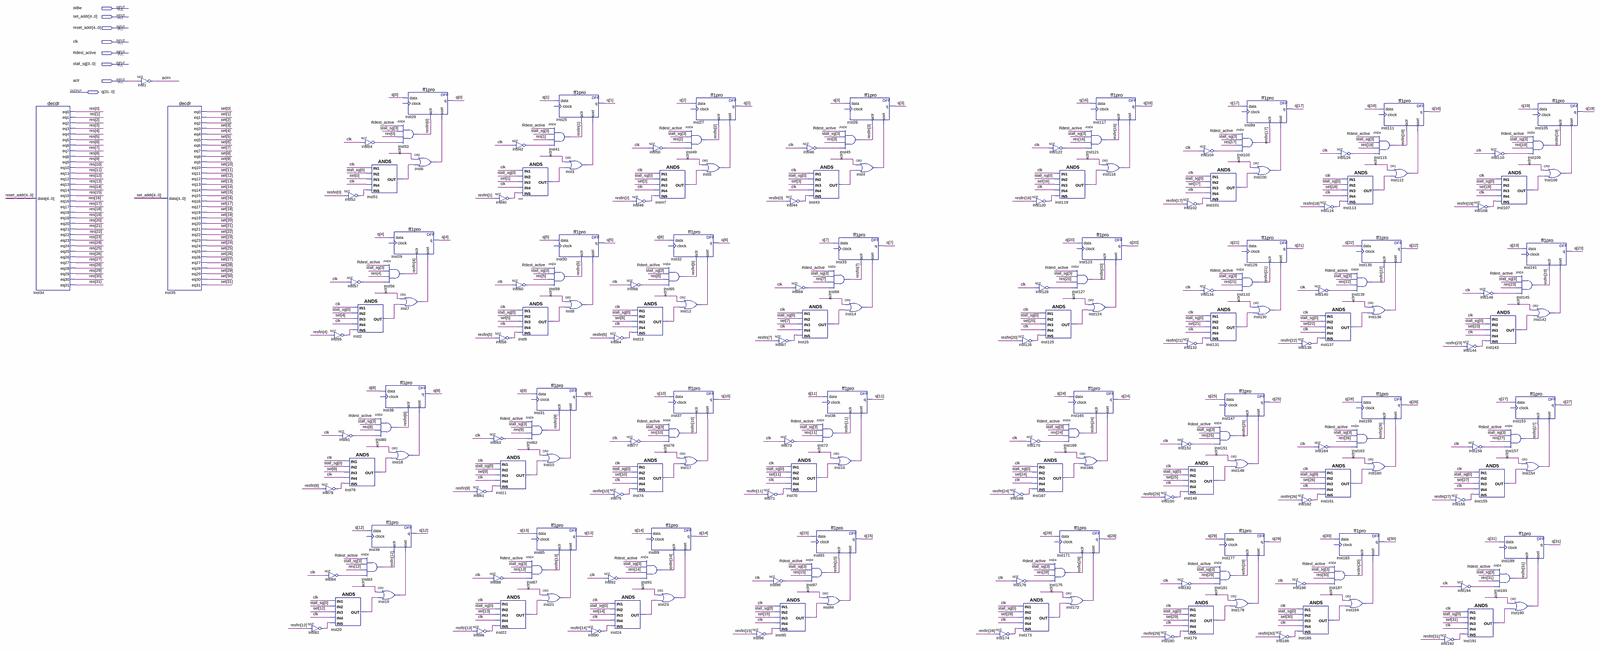
[diagram p0: schematic sheet, whole]
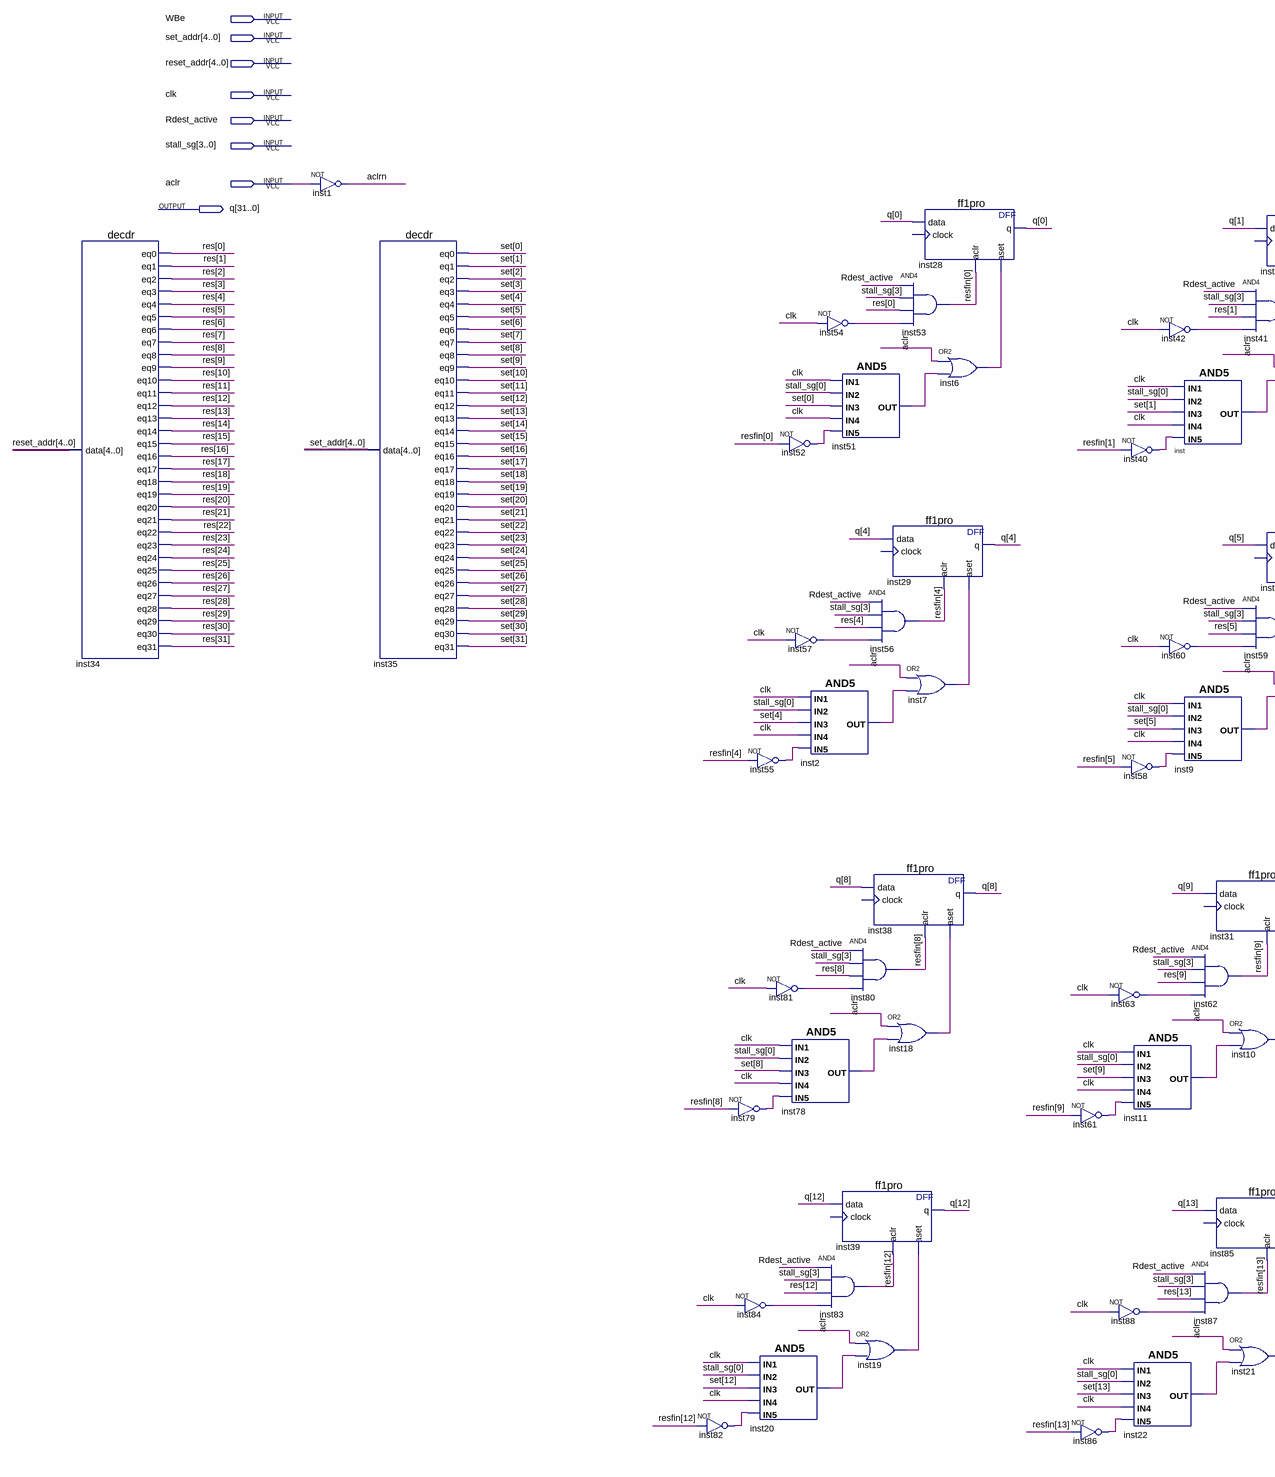
[diagram p1: schematic sheet, left part]
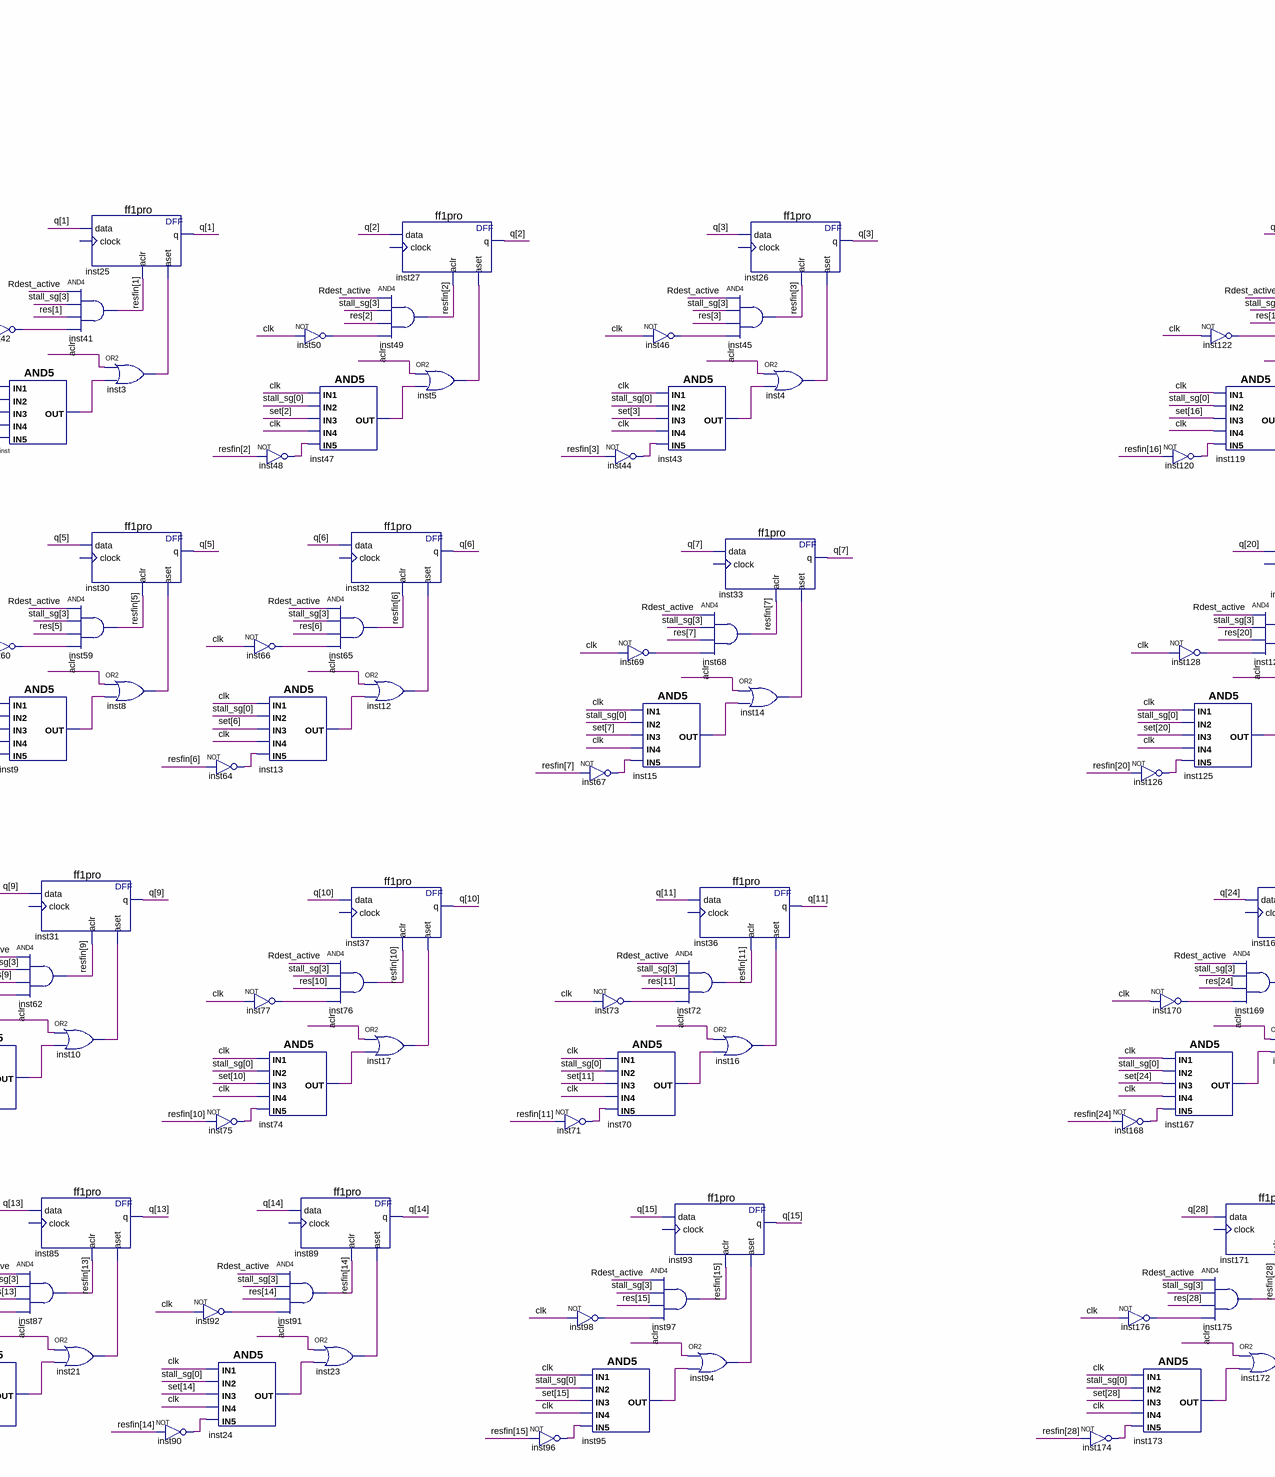
[diagram p2: schematic sheet, centre part]
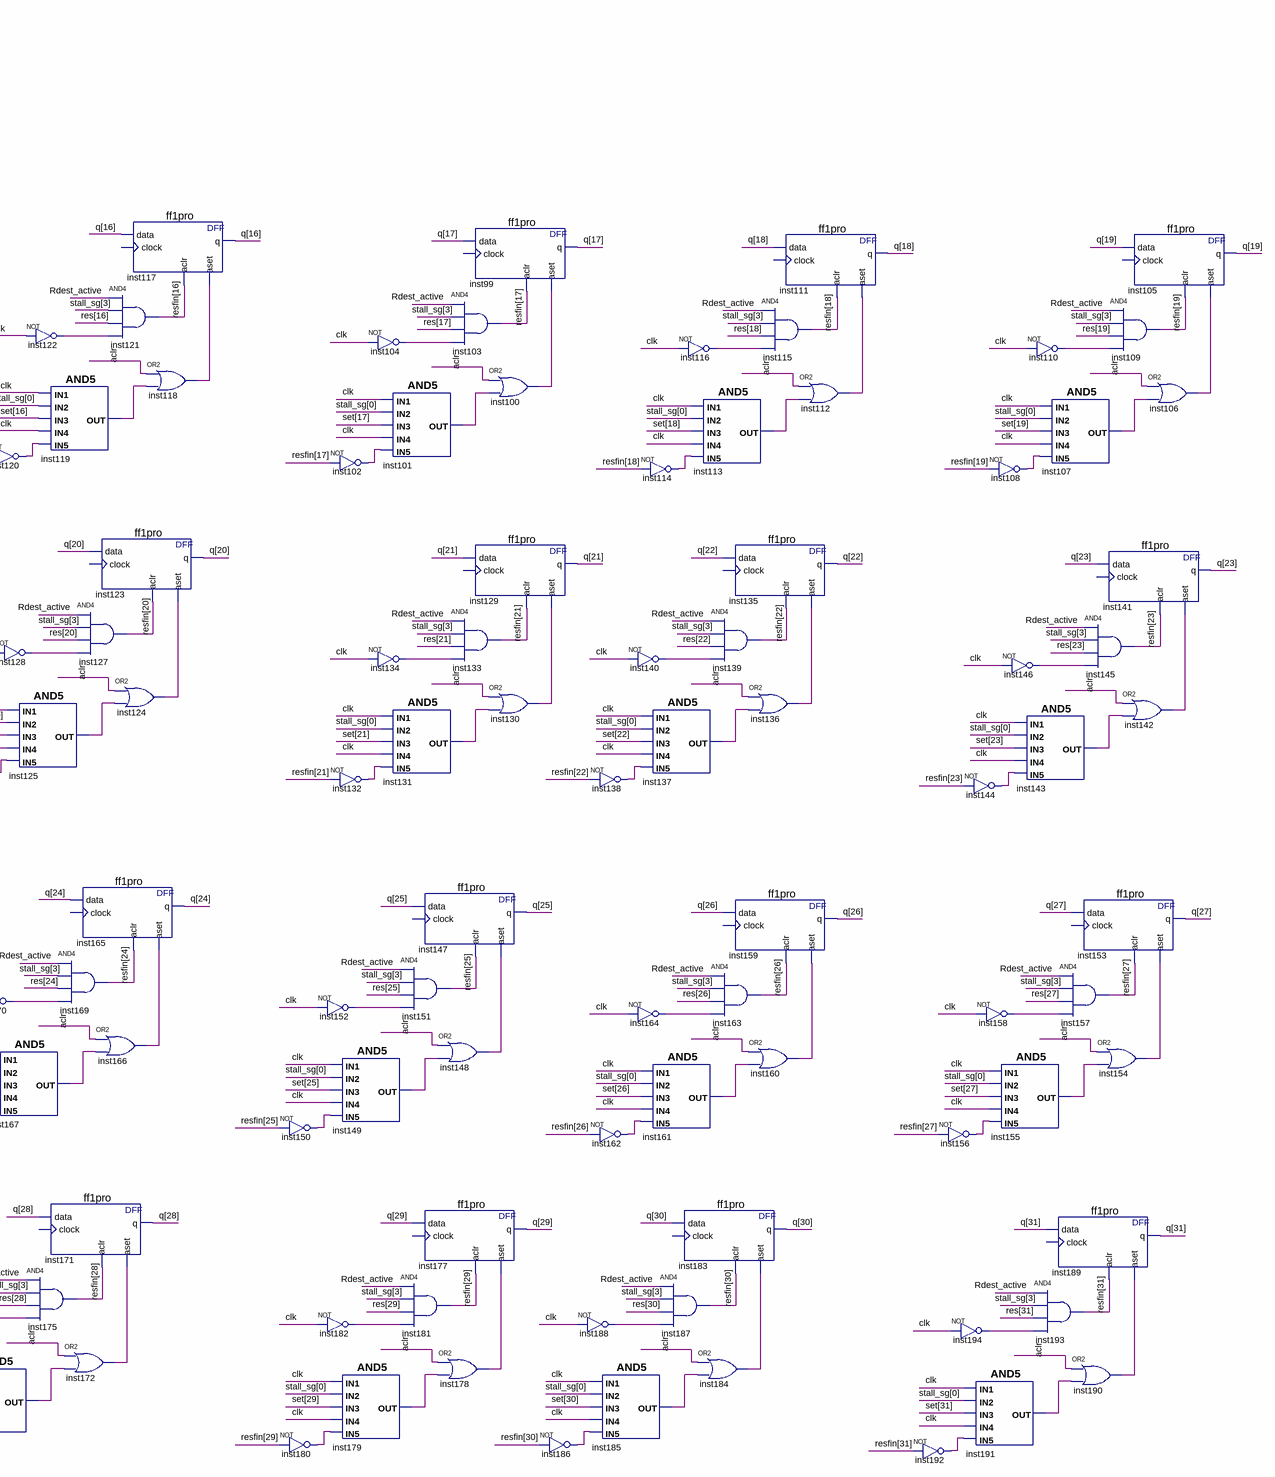
[diagram p3: schematic sheet, right part]
// Quartus schematic Stall_Array.bdf as structural Verilog: 195 symbols, 8 pins
module Stall_Array (
  input  WBe,
  input  [4:0] set_addr,
  input  [4:0] reset_addr,
  input  clk,
  input  Rdest_active,
  input  [3:0] stall_sg,
  input  aclr,
  output [31:0] q
);

  wire aclrn, inst2_out, inst3_out, inst4_out, inst5_out, inst6_out, inst7_out, inst8_out, inst9_out,
       inst10_out, inst11_out, inst12_out, inst13_out, inst14_out, inst15_out, inst16_out, inst17_out,
       inst18_out, inst19_out, inst20_out, inst21_out, inst22_out, inst23_out, inst24_out, inst40_out,
       inst42_out, inst43_out, inst44_out, inst46_out, inst47_out, inst48_out, inst50_out, inst51_out,
       inst52_out, inst54_out, inst55_out, inst57_out, inst58_out, inst60_out, inst61_out, inst63_out,
       inst64_out, inst66_out, inst67_out, inst69_out, inst70_out, inst71_out, inst73_out, inst74_out,
       inst75_out, inst77_out, inst78_out, inst79_out, inst81_out, inst82_out, inst84_out, inst86_out,
       inst88_out, inst90_out, inst92_out, inst94_out, inst95_out, inst96_out, inst98_out, inst100_out,
       inst101_out, inst102_out, inst104_out, inst106_out, inst107_out, inst108_out, inst110_out,
       inst112_out, inst113_out, inst114_out, inst116_out, inst118_out, inst119_out, inst120_out,
       inst122_out, inst124_out, inst125_out, inst126_out, inst128_out, inst130_out, inst131_out,
       inst132_out, inst134_out, inst136_out, inst137_out, inst138_out, inst140_out, inst142_out,
       inst143_out, inst144_out, inst146_out, inst148_out, inst149_out, inst150_out, inst152_out,
       inst154_out, inst155_out, inst156_out, inst158_out, inst160_out, inst161_out, inst162_out,
       inst164_out, inst166_out, inst167_out, inst168_out, inst170_out, inst172_out, inst173_out,
       inst174_out, inst176_out, inst178_out, inst179_out, inst180_out, inst182_out, inst184_out,
       inst185_out, inst186_out, inst188_out, inst190_out, inst191_out, inst192_out, inst194_out, inst_out;
  wire [31:0] res, resfin, set;

  decdr inst34 (
    .data(reset_addr), .eq0(res[0]), .eq1(res[1]), .eq2(res[2]), .eq3(res[3]), .eq4(res[4]), .eq5(res[5]),
    .eq6(res[6]), .eq7(res[7]), .eq8(res[8]), .eq9(res[9]), .eq10(res[10]), .eq11(res[11]), .eq12(res[12]),
    .eq13(res[13]), .eq14(res[14]), .eq15(res[15]), .eq16(res[16]), .eq17(res[17]), .eq18(res[18]),
    .eq19(res[19]), .eq20(res[20]), .eq21(res[21]), .eq22(res[22]), .eq23(res[23]), .eq24(res[24]),
    .eq25(res[25]), .eq26(res[26]), .eq27(res[27]), .eq28(res[28]), .eq29(res[29]), .eq30(res[30]),
    .eq31(res[31]));
  not inst1 (aclrn, aclr);
  decdr inst35 (
    .data(set_addr), .eq0(set[0]), .eq1(set[1]), .eq2(set[2]), .eq3(set[3]), .eq4(set[4]), .eq5(set[5]),
    .eq6(set[6]), .eq7(set[7]), .eq8(set[8]), .eq9(set[9]), .eq10(set[10]), .eq11(set[11]), .eq12(set[12]),
    .eq13(set[13]), .eq14(set[14]), .eq15(set[15]), .eq16(set[16]), .eq17(set[17]), .eq18(set[18]),
    .eq19(set[19]), .eq20(set[20]), .eq21(set[21]), .eq22(set[22]), .eq23(set[23]), .eq24(set[24]),
    .eq25(set[25]), .eq26(set[26]), .eq27(set[27]), .eq28(set[28]), .eq29(set[29]), .eq30(set[30]),
    .eq31(set[31]));
  not inst82 (inst82_out, resfin[12]);
  not inst55 (inst55_out, resfin[4]);
  not inst79 (inst79_out, resfin[8]);
  not inst84 (inst84_out, clk);
  and inst20 (inst20_out, clk, stall_sg[0], set[12], clk, inst82_out);
  not inst52 (inst52_out, resfin[0]);
  not inst57 (inst57_out, clk);
  and inst2 (inst2_out, clk, stall_sg[0], set[4], clk, inst55_out);
  not inst81 (inst81_out, clk);
  and inst78 (inst78_out, clk, stall_sg[0], set[8], clk, inst79_out);
  not inst54 (inst54_out, clk);
  and inst51 (inst51_out, clk, stall_sg[0], set[0], clk, inst52_out);
  and inst80 (resfin[8], Rdest_active, stall_sg[3], res[8], inst81_out);
  ff1pro inst39 (.data(q[12]), .aclr(resfin[12]), .aset(inst19_out), .q(q[12]));  // open: clock
  and inst83 (resfin[12], Rdest_active, stall_sg[3], res[12], inst84_out);
  or inst19 (inst19_out, aclr, inst20_out);
  and inst53 (resfin[0], Rdest_active, stall_sg[3], res[0], inst54_out);
  ff1pro inst29 (.data(q[4]), .aclr(resfin[4]), .aset(inst7_out), .q(q[4]));  // open: clock
  and inst56 (resfin[4], Rdest_active, stall_sg[3], res[4], inst57_out);
  or inst7 (inst7_out, aclr, inst2_out);
  ff1pro inst38 (.data(q[8]), .aclr(resfin[8]), .aset(inst18_out), .q(q[8]));  // open: clock
  or inst18 (inst18_out, aclr, inst78_out);
  ff1pro inst28 (.data(q[0]), .aclr(resfin[0]), .aset(inst6_out), .q(q[0]));  // open: clock
  or inst6 (inst6_out, aclr, inst51_out);
  not inst63 (inst63_out, clk);
  not inst61 (inst61_out, resfin[9]);
  not inst88 (inst88_out, clk);
  not inst86 (inst86_out, resfin[13]);
  not inst42 (inst42_out, clk);
  not inst40 (inst40_out, resfin[1]);
  not inst60 (inst60_out, clk);
  not inst58 (inst58_out, resfin[5]);
  and inst11 (inst11_out, clk, stall_sg[0], set[9], clk, inst61_out);
  and inst22 (inst22_out, clk, stall_sg[0], set[13], clk, inst86_out);
  and inst (inst_out, clk, stall_sg[0], set[1], clk, inst40_out);
  and inst9 (inst9_out, clk, stall_sg[0], set[5], clk, inst58_out);
  ff1pro inst31 (.data(q[9]), .aclr(resfin[9]), .aset(inst10_out), .q(q[9]));  // open: clock
  and inst62 (resfin[9], Rdest_active, stall_sg[3], res[9], inst63_out);
  ff1pro inst85 (.data(q[13]), .aclr(resfin[13]), .aset(inst21_out), .q(q[13]));  // open: clock
  and inst87 (resfin[13], Rdest_active, stall_sg[3], res[13], inst88_out);
  ff1pro inst25 (.data(q[1]), .aclr(resfin[1]), .aset(inst3_out), .q(q[1]));  // open: clock
  and inst41 (resfin[1], Rdest_active, stall_sg[3], res[1], inst42_out);
  ff1pro inst30 (.data(q[5]), .aclr(resfin[5]), .aset(inst8_out), .q(q[5]));  // open: clock
  and inst59 (resfin[5], Rdest_active, stall_sg[3], res[5], inst60_out);
  or inst10 (inst10_out, aclr, inst11_out);
  or inst21 (inst21_out, aclr, inst22_out);
  or inst3 (inst3_out, aclr, inst_out);
  or inst8 (inst8_out, aclr, inst9_out);
  not inst90 (inst90_out, resfin[14]);
  not inst64 (inst64_out, resfin[6]);
  not inst75 (inst75_out, resfin[10]);
  not inst92 (inst92_out, clk);
  and inst24 (inst24_out, clk, stall_sg[0], set[14], clk, inst90_out);
  not inst48 (inst48_out, resfin[2]);
  not inst66 (inst66_out, clk);
  and inst13 (inst13_out, clk, stall_sg[0], set[6], clk, inst64_out);
  not inst77 (inst77_out, clk);
  and inst74 (inst74_out, clk, stall_sg[0], set[10], clk, inst75_out);
  ff1pro inst89 (.data(q[14]), .aclr(resfin[14]), .aset(inst23_out), .q(q[14]));  // open: clock
  and inst91 (resfin[14], Rdest_active, stall_sg[3], res[14], inst92_out);
  not inst50 (inst50_out, clk);
  and inst47 (inst47_out, clk, stall_sg[0], set[2], clk, inst48_out);
  ff1pro inst32 (.data(q[6]), .aclr(resfin[6]), .aset(inst12_out), .q(q[6]));  // open: clock
  and inst65 (resfin[6], Rdest_active, stall_sg[3], res[6], inst66_out);
  ff1pro inst37 (.data(q[10]), .aclr(resfin[10]), .aset(inst17_out), .q(q[10]));  // open: clock
  and inst76 (resfin[10], Rdest_active, stall_sg[3], res[10], inst77_out);
  or inst23 (inst23_out, aclr, inst24_out);
  ff1pro inst27 (.data(q[2]), .aclr(resfin[2]), .aset(inst5_out), .q(q[2]));  // open: clock
  and inst49 (resfin[2], Rdest_active, stall_sg[3], res[2], inst50_out);
  or inst12 (inst12_out, aclr, inst13_out);
  or inst17 (inst17_out, aclr, inst74_out);
  or inst5 (inst5_out, aclr, inst47_out);
  not inst96 (inst96_out, resfin[15]);
  not inst67 (inst67_out, resfin[7]);
  not inst73 (inst73_out, clk);
  not inst71 (inst71_out, resfin[11]);
  not inst98 (inst98_out, clk);
  and inst95 (inst95_out, clk, stall_sg[0], set[15], clk, inst96_out);
  not inst46 (inst46_out, clk);
  not inst44 (inst44_out, resfin[3]);
  not inst69 (inst69_out, clk);
  and inst15 (inst15_out, clk, stall_sg[0], set[7], clk, inst67_out);
  and inst70 (inst70_out, clk, stall_sg[0], set[11], clk, inst71_out);
  and inst43 (inst43_out, clk, stall_sg[0], set[3], clk, inst44_out);
  ff1pro inst36 (.data(q[11]), .aclr(resfin[11]), .aset(inst16_out), .q(q[11]));  // open: clock
  and inst72 (resfin[11], Rdest_active, stall_sg[3], res[11], inst73_out);
  ff1pro inst93 (.data(q[15]), .aclr(resfin[15]), .aset(inst94_out), .q(q[15]));  // open: clock
  and inst97 (resfin[15], Rdest_active, stall_sg[3], res[15], inst98_out);
  or inst94 (inst94_out, aclr, inst95_out);
  ff1pro inst26 (.data(q[3]), .aclr(resfin[3]), .aset(inst4_out), .q(q[3]));  // open: clock
  and inst45 (resfin[3], Rdest_active, stall_sg[3], res[3], inst46_out);
  ff1pro inst33 (.data(q[7]), .aclr(resfin[7]), .aset(inst14_out), .q(q[7]));  // open: clock
  and inst68 (resfin[7], Rdest_active, stall_sg[3], res[7], inst69_out);
  or inst14 (inst14_out, aclr, inst15_out);
  or inst16 (inst16_out, aclr, inst70_out);
  or inst4 (inst4_out, aclr, inst43_out);
  not inst174 (inst174_out, resfin[28]);
  not inst126 (inst126_out, resfin[20]);
  not inst170 (inst170_out, clk);
  not inst168 (inst168_out, resfin[24]);
  not inst176 (inst176_out, clk);
  and inst173 (inst173_out, clk, stall_sg[0], set[28], clk, inst174_out);
  not inst122 (inst122_out, clk);
  not inst120 (inst120_out, resfin[16]);
  not inst128 (inst128_out, clk);
  and inst125 (inst125_out, clk, stall_sg[0], set[20], clk, inst126_out);
  and inst167 (inst167_out, clk, stall_sg[0], set[24], clk, inst168_out);
  and inst175 (resfin[28], Rdest_active, stall_sg[3], res[28], inst176_out);
  and inst119 (inst119_out, clk, stall_sg[0], set[16], clk, inst120_out);
  and inst127 (resfin[20], Rdest_active, stall_sg[3], res[20], inst128_out);
  ff1pro inst165 (.data(q[24]), .aclr(resfin[24]), .aset(inst166_out), .q(q[24]));  // open: clock
  and inst169 (resfin[24], Rdest_active, stall_sg[3], res[24], inst170_out);
  ff1pro inst171 (.data(q[28]), .aclr(resfin[28]), .aset(inst172_out), .q(q[28]));  // open: clock
  or inst172 (inst172_out, aclr, inst173_out);
  ff1pro inst117 (.data(q[16]), .aclr(resfin[16]), .aset(inst118_out), .q(q[16]));  // open: clock
  and inst121 (resfin[16], Rdest_active, stall_sg[3], res[16], inst122_out);
  ff1pro inst123 (.data(q[20]), .aclr(resfin[20]), .aset(inst124_out), .q(q[20]));  // open: clock
  or inst124 (inst124_out, aclr, inst125_out);
  or inst166 (inst166_out, aclr, inst167_out);
  or inst118 (inst118_out, aclr, inst119_out);
  not inst150 (inst150_out, resfin[25]);
  not inst180 (inst180_out, resfin[29]);
  not inst102 (inst102_out, resfin[17]);
  not inst132 (inst132_out, resfin[21]);
  not inst152 (inst152_out, clk);
  and inst149 (inst149_out, clk, stall_sg[0], set[25], clk, inst150_out);
  not inst182 (inst182_out, clk);
  and inst179 (inst179_out, clk, stall_sg[0], set[29], clk, inst180_out);
  not inst104 (inst104_out, clk);
  and inst101 (inst101_out, clk, stall_sg[0], set[17], clk, inst102_out);
  not inst134 (inst134_out, clk);
  and inst131 (inst131_out, clk, stall_sg[0], set[21], clk, inst132_out);
  ff1pro inst147 (.data(q[25]), .aclr(resfin[25]), .aset(inst148_out), .q(q[25]));  // open: clock
  and inst151 (resfin[25], Rdest_active, stall_sg[3], res[25], inst152_out);
  ff1pro inst177 (.data(q[29]), .aclr(resfin[29]), .aset(inst178_out), .q(q[29]));  // open: clock
  and inst181 (resfin[29], Rdest_active, stall_sg[3], res[29], inst182_out);
  ff1pro inst99 (.data(q[17]), .aclr(resfin[17]), .aset(inst100_out), .q(q[17]));  // open: clock
  and inst103 (resfin[17], Rdest_active, stall_sg[3], res[17], inst104_out);
  ff1pro inst129 (.data(q[21]), .aclr(resfin[21]), .aset(inst130_out), .q(q[21]));  // open: clock
  and inst133 (resfin[21], Rdest_active, stall_sg[3], res[21], inst134_out);
  or inst148 (inst148_out, aclr, inst149_out);
  or inst178 (inst178_out, aclr, inst179_out);
  or inst100 (inst100_out, aclr, inst101_out);
  or inst130 (inst130_out, aclr, inst131_out);
  not inst188 (inst188_out, clk);
  not inst186 (inst186_out, resfin[30]);
  not inst140 (inst140_out, clk);
  not inst138 (inst138_out, resfin[22]);
  not inst164 (inst164_out, clk);
  not inst162 (inst162_out, resfin[26]);
  and inst185 (inst185_out, clk, stall_sg[0], set[30], clk, inst186_out);
  not inst116 (inst116_out, clk);
  not inst114 (inst114_out, resfin[18]);
  and inst137 (inst137_out, clk, stall_sg[0], set[22], clk, inst138_out);
  and inst161 (inst161_out, clk, stall_sg[0], set[26], clk, inst162_out);
  ff1pro inst183 (.data(q[30]), .aclr(resfin[30]), .aset(inst184_out), .q(q[30]));  // open: clock
  and inst187 (resfin[30], Rdest_active, stall_sg[3], res[30], inst188_out);
  and inst113 (inst113_out, clk, stall_sg[0], set[18], clk, inst114_out);
  ff1pro inst135 (.data(q[22]), .aclr(resfin[22]), .aset(inst136_out), .q(q[22]));  // open: clock
  and inst139 (resfin[22], Rdest_active, stall_sg[3], res[22], inst140_out);
  ff1pro inst159 (.data(q[26]), .aclr(resfin[26]), .aset(inst160_out), .q(q[26]));  // open: clock
  and inst163 (resfin[26], Rdest_active, stall_sg[3], res[26], inst164_out);
  or inst184 (inst184_out, aclr, inst185_out);
  ff1pro inst111 (.data(q[18]), .aclr(resfin[18]), .aset(inst112_out), .q(q[18]));  // open: clock
  and inst115 (resfin[18], Rdest_active, stall_sg[3], res[18], inst116_out);
  or inst136 (inst136_out, aclr, inst137_out);
  or inst160 (inst160_out, aclr, inst161_out);
  or inst112 (inst112_out, aclr, inst113_out);
  not inst156 (inst156_out, resfin[27]);
  not inst192 (inst192_out, resfin[31]);
  not inst108 (inst108_out, resfin[19]);
  not inst144 (inst144_out, resfin[23]);
  not inst158 (inst158_out, clk);
  and inst155 (inst155_out, clk, stall_sg[0], set[27], clk, inst156_out);
  not inst194 (inst194_out, clk);
  and inst191 (inst191_out, clk, stall_sg[0], set[31], clk, inst192_out);
  not inst110 (inst110_out, clk);
  and inst107 (inst107_out, clk, stall_sg[0], set[19], clk, inst108_out);
  not inst146 (inst146_out, clk);
  and inst143 (inst143_out, clk, stall_sg[0], set[23], clk, inst144_out);
  and inst193 (resfin[31], Rdest_active, stall_sg[3], res[31], inst194_out);
  and inst145 (resfin[23], Rdest_active, stall_sg[3], res[23], inst146_out);
  ff1pro inst153 (.data(q[27]), .aclr(resfin[27]), .aset(inst154_out), .q(q[27]));  // open: clock
  and inst157 (resfin[27], Rdest_active, stall_sg[3], res[27], inst158_out);
  ff1pro inst189 (.data(q[31]), .aclr(resfin[31]), .aset(inst190_out), .q(q[31]));  // open: clock
  or inst190 (inst190_out, aclr, inst191_out);
  ff1pro inst105 (.data(q[19]), .aclr(resfin[19]), .aset(inst106_out), .q(q[19]));  // open: clock
  and inst109 (resfin[19], Rdest_active, stall_sg[3], res[19], inst110_out);
  ff1pro inst141 (.data(q[23]), .aclr(resfin[23]), .aset(inst142_out), .q(q[23]));  // open: clock
  or inst142 (inst142_out, aclr, inst143_out);
  or inst154 (inst154_out, aclr, inst155_out);
  or inst106 (inst106_out, aclr, inst107_out);
endmodule
